# EAGLE design sender v2 (EAGLE 5.10)
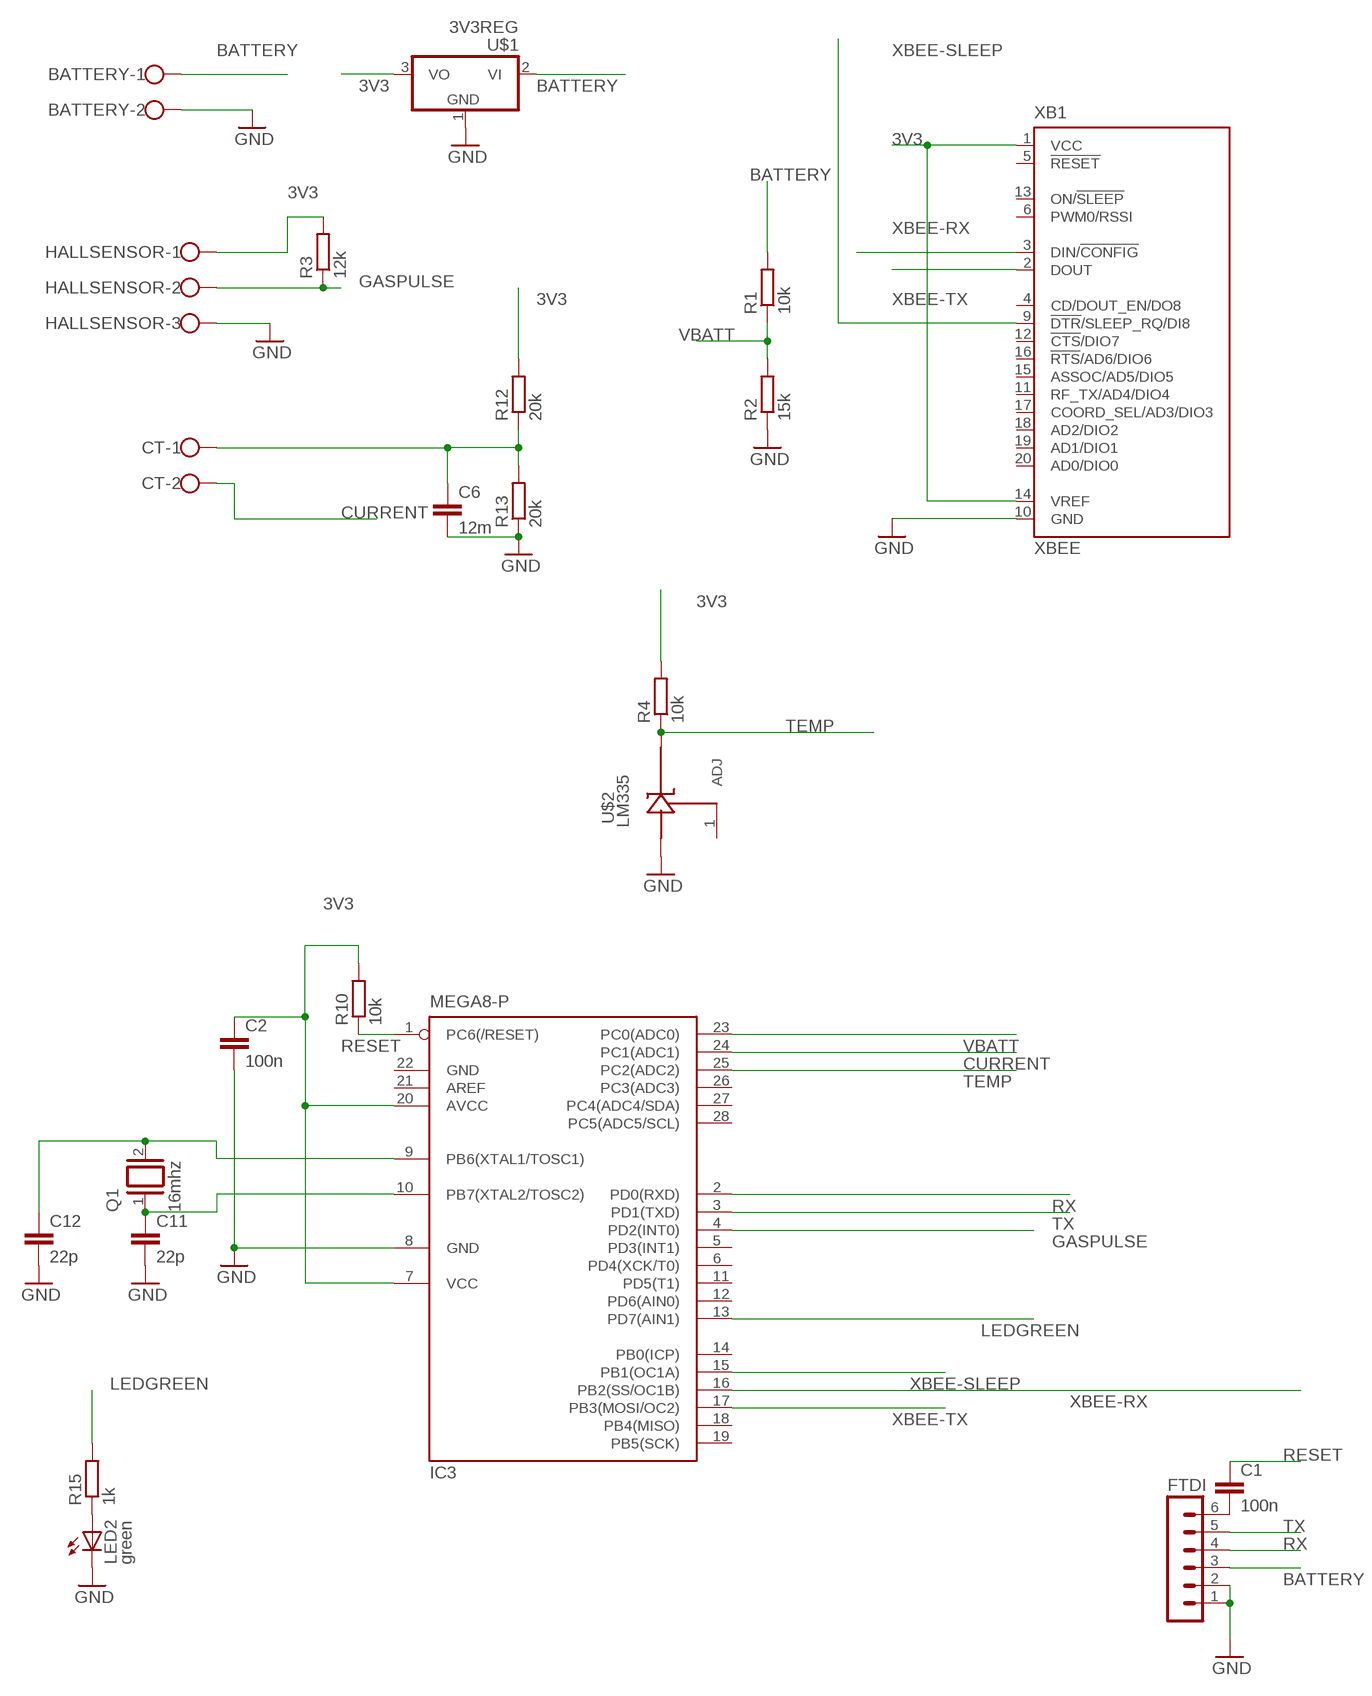
[diagram p0: schematic, sheet 1]

## Parts
BATTERY  W237-102  [W237-102]
C1  100n  C5/2.5  [C5B2.5]
C2  100n  C5/2.5  [C5B2.5]
C6  12m  C5/2.5  [C5B2.5]
C11  22p  C-EU050-025X075  [C050-025X075]
C12  22p  C-EU050-025X075  [C050-025X075]
CT  W237-102  [W237-102]
FTDI  MA06-1  [MA06-1]
HALLSENSOR  W237-103  [W237-103]
IC3  MEGA8-P  [DIL28-3]
LED2  green  LED5MM  [LED5MM]
Q1  16mhz  XTAL/S  [QS]
R1  10k  R-EU_0204/7  [0204/7]
R2  15k  R-EU_0204/7  [0204/7]
R3  12k  R-EU_0204/7  [0204/7]
R4  10k  R-EU_0204/7  [0204/7]
R10  10k  R-EU_0204/7  [0204/7]
R12  20k  R-EU_0204/7  [0204/7]
R13  20k  R-EU_0204/7  [0204/7]
R15  1k  R-EU_0204/7  [0204/7]
U$1  3V3REG  [TO92]
U$2  LM335  [TO92]
XB1  XBEE  [XBEE]

## Nets
3V3: C2.1 HALLSENSOR.1 IC3.7(VCC) IC3.20(AVCC) R3.2 R4.2 R10.2 R12.2 U$1.3(VO) XB1.1(VCC) XB1.14(VREF)
BATTERY [power]: BATTERY.1 FTDI.3 R1.2 U$1.2(VI)
CURRENT: CT.2 IC3.24(PC1(ADC1))
GASPULSE: HALLSENSOR.2 IC3.4(PD2(INT0)) R3.1
GND: BATTERY.2 C2.2 C6.2 C11.2 C12.2 FTDI.1 FTDI.2 HALLSENSOR.3 IC3.8(GND) LED2.K(C) R2.1 R13.1 U$1.1(GND) U$2.3(OUT) XB1.10(GND)
LEDGREEN: IC3.13(PD7(AIN1)) R15.2
N$5: C1.2 FTDI.6
N$10: C11.1 IC3.10(PB7(XTAL2/TOSC2)) Q1.1
N$11: C12.1 IC3.9(PB6(XTAL1/TOSC1)) Q1.2
N$15: LED2.A R15.1
RESET: C1.1 IC3.1(PC6(/RESET)) R10.1
RX: FTDI.4 IC3.2(PD0(RXD))
TEMP: IC3.25(PC2(ADC2)) R4.1 U$2.2(IN)
TX: FTDI.5 IC3.3(PD1(TXD))
VBATT: IC3.23(PC0(ADC0)) R1.1 R2.2
VBIAS: C6.1 CT.1 R12.1 R13.2
XBEE-RX: IC3.16(PB2(SS/OC1B)) XB1.3(DIN/!CONFIG)
XBEE-SLEEP: IC3.15(PB1(OC1A)) XB1.9(!DTR!/SLEEP_RQ/DI8)
XBEE-TX: IC3.17(PB3(MOSI/OC2)) XB1.2(DOUT)
Unconnected: IC3.5(PD3(INT1)) IC3.6(PD4(XCK/T0)) IC3.11(PD5(T1)) IC3.12(PD6(AIN0)) IC3.14(PB0(ICP)) IC3.18(PB4(MISO)) IC3.19(PB5(SCK)) IC3.21(AREF) IC3.26(PC3(ADC3)) IC3.27(PC4(ADC4/SDA)) IC3.28(PC5(ADC5/SCL)) U$2.1(ADJ) XB1.4(CD/DOUT_EN/DO8) XB1.5(!RESET) XB1.6(PWM0/RSSI) XB1.11(RF_TX/AD4/DIO4) XB1.12(!CTS!/DIO7) XB1.13(ON/!SLEEP) XB1.15(ASSOC/AD5/DIO5) XB1.16(!RTS!/AD6/DIO6) XB1.17(COORD_SEL/AD3/DIO3) XB1.18(AD2/DIO2) XB1.19(AD1/DIO1) XB1.20(AD0/DIO0)

## Power pins joined to a net without a drawn wire
GND: IC3.22(GND)

## Library data of the parts
BATTERY CT = con-wago-500:W237-102: WAGO SCREW CLAMP
C1 C2 C6 = capacitor-wima:C: CAPACITOR naming: grid - package width
C11 C12 = rcl:C-EU: CAPACITOR, European symbol
FTDI = con-lstb:MA06-1: PIN HEADER
HALLSENSOR = con-wago-500:W237-103: WAGO SCREW CLAMP
IC3 = atmel:MEGA8-P: MICROCONTROLLER 8 Kbytes FLASH, 1 kbytes SRAM, 512 bytes EEPROM, USART, 4-channel 10 bit ADC, 2-channel 8 bit ADC Pin compatible with Atmega48, ATMega88, ATMega168 Source: avr.lbr
LED2 = led:LED: LED OSRAM: - CHIPLED LG R971, LG N971, LY N971, LG Q971, LY Q971, LO R971, LY R971 LH N974, LH R974 LS Q976, LO Q976, LY Q976 LO Q996 - Hyper CHIPLED LW Q18S LB Q993, LB Q99A, LB R99A - SideLED LS A670, LO A670, LY A670, LG A670, LP A670 LB A673, LV A673, LT A673, LW A673 LH A674 LY A675 LS A676, LA A676, LO A676, LY A676, LW A676 LS A679, LY A679, LG A679 - Hyper Micro SIDELED® LS Y876, LA Y876, LO Y876, LY Y876 LT Y87S - SmartLED LW L88C, LW L88S LB L89C, LB L89S, LG L890 LS L89K, LO L89K, LY L89K LS L896, LA L896, LO L896, LY L896 - TOPLED LS T670, LO T670, LY T670, LG T670, LP T670 LSG T670, LSP T670, LSY T670, LOP T670, LYG T670 LG T671, LOG T671, LSG T671 LB T673, LV T673, LT T673, LW T673 LH T674 LS T676, LA T676, LO T676, LY T676, LB T676, LH T676, LSB T676, LW T676 LB T67C, LV T67C, LT T67C, LS T67K, LO T67K, LY T67K, LW E67C LS E67B, LA E67B, LO E67B, LY E67B, LB E67C, LV E67C, LT E67C LW T67C LS T679, LY T679, LG T679 LS T770, LO T770, LY T770, LG T770, LP T770 LB T773, LV T773, LT T773, LW T773 LH T774 LS E675, LA E675, LY E675, LS T675 LS T776, LA T776, LO T776, LY T776, LB T776 LHGB T686 LT T68C, LB T68C - Hyper Mini TOPLED® LB M676 - Mini TOPLED Santana® LG M470 LS M47K, LO M47K, LY M47K Source: http://www.osram.convergy.de LUXEON: - LUMILED® LXK2-PW12-R00, LXK2-PW12-S00, LXK2-PW14-U00, LXK2-PW14-V00 LXK2-PM12-R00, LXK2-PM12-S00, LXK2-PM14-U00 LXK2-PE12-Q00, LXK2-PE12-R00, LXK2-PE12-S00, LXK2-PE14-T00, LXK2-PE14-U00 LXK2-PB12-K00, LXK2-PB12-L00, LXK2-PB12-M00, LXK2-PB14-N00, LXK2-PB14-P00, LXK2-PB14-Q00 LXK2-PR12-L00, LXK2-PR12-M00, LXK2-PR14-Q00, LXK2-PR14-R00 LXK2-PD12-Q00, LXK2-PD12-R00, LXK2-PD12-S00 LXK2-PH12-R00, LXK2-PH12-S00 LXK2-PL12-P00, LXK2-PL12-Q00, LXK2-PL12-R00 Source: www.luxeon.com KINGBRIGHT: KA-3528ASYC Source: www.kingbright.com
Q1 = special:XTAL/S: CRYSTAL
R1-R4 R10 R12 R13 R15 = rcl:R-EU_: RESISTOR, European symbol
U$1 = matt:3V3REG
U$2 = matt:LM335
XB1 = maxstream:XBEE: XBee (TM) /XBee-PRO(TM) OEM RF Modules Source: MaxStream, Inc. xbee_productmanual.pdf

## Net classes
1 power: width 2 mm

## Board
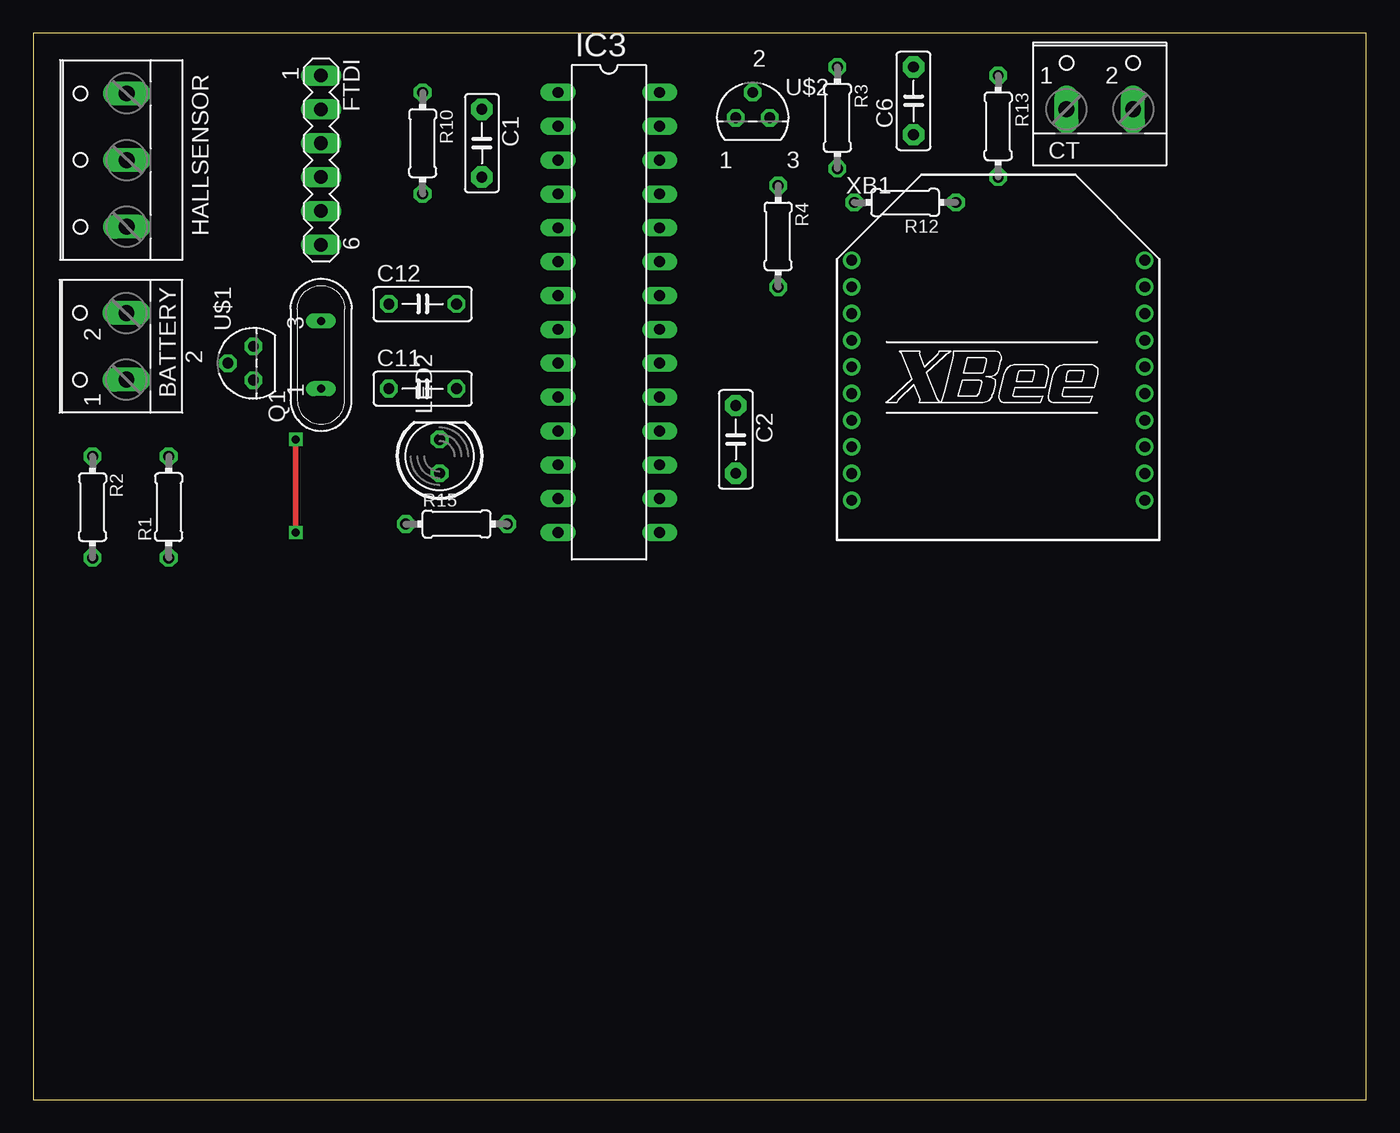
[diagram p1: board, top side]
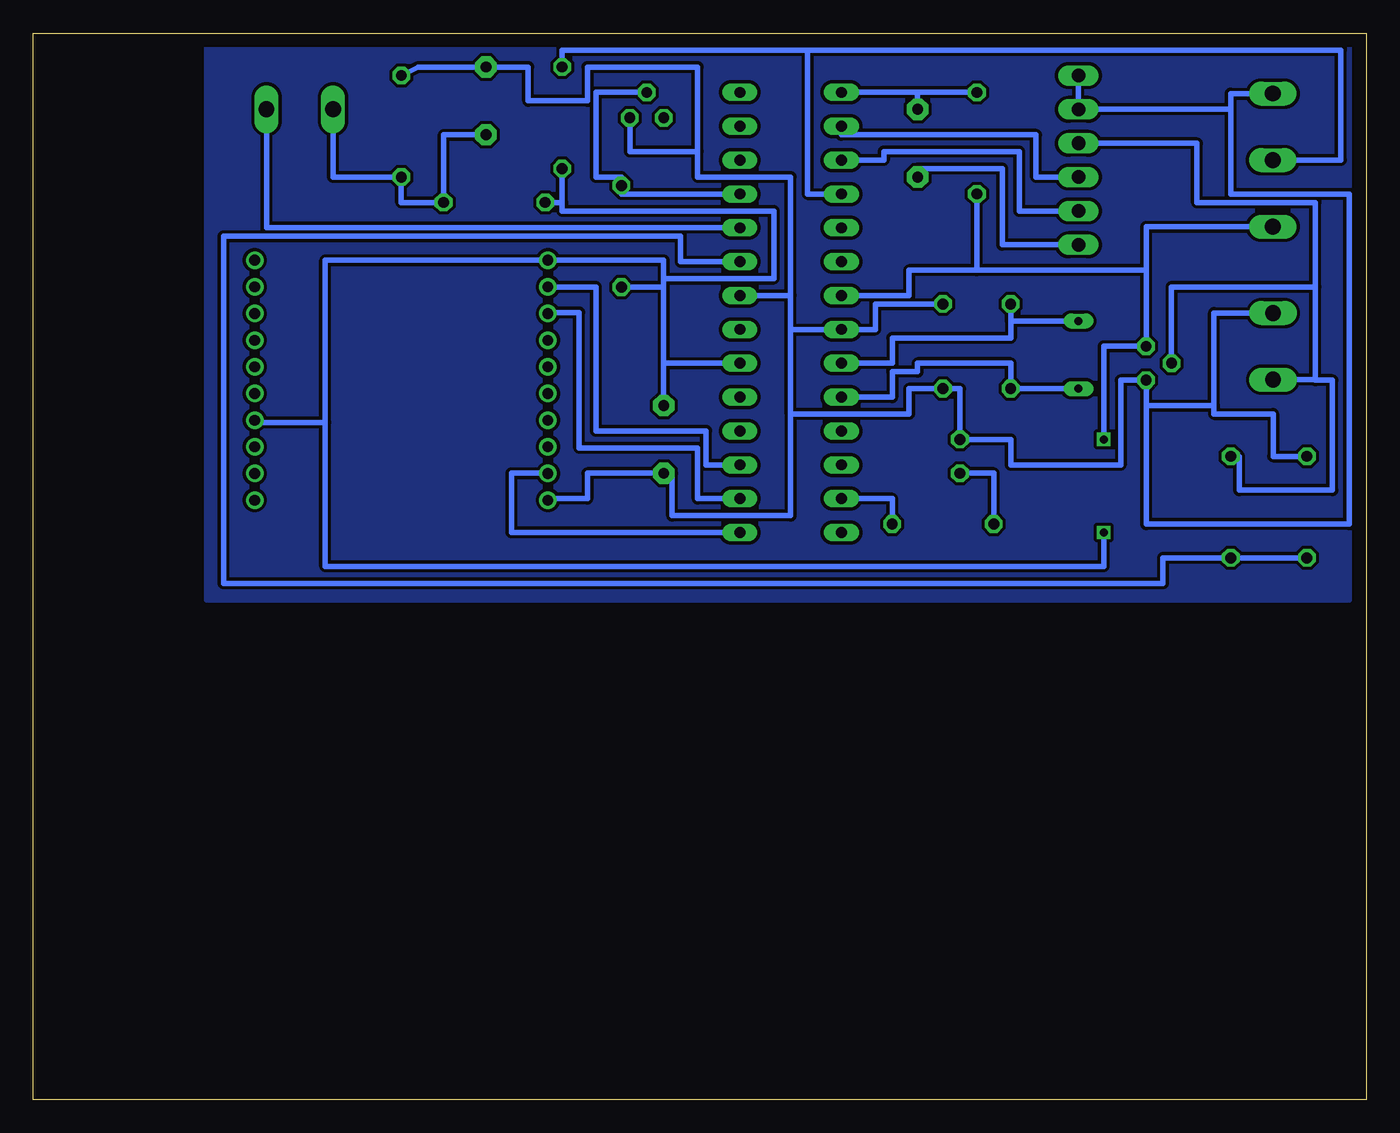
[diagram p2: board, bottom side, seen from below]

Size 100 x 80 mm. Coordinates in mm from the lower left corner, seen from the top.
Outline: 0,0 100,0 100,80 0,80 0,0
Copper layers (1*16): Top 0.035mm / dielectric 1.5mm / Bottom 0.035mm
Design rules "default *": minimum track width 10mil, minimum drill 24mil, track to track 8mil, track to pad 8mil, pad to pad 8mil, via to via 8mil, smd to smd 8mil, copper to edge 40mil, drill to drill 8mil, minimum pad ring 10mil, minimum via ring 8mil, stop-mask expansion 4mil, vias tented up to drill 0mil, thermal gap 10mil

### Footprints (pad centres in the part's own frame; a part is rotated, then mirrored left to right if it is on the bottom)
W237-102 = drill 1.194 long: 1 -2.5,-1.27; 2 2.5,-1.27
C5B2.5 = drill 0.813 pad 1.6 octagon: 1 -2.54,0; 2 2.54,0
C050-025X075 = drill 0.813 octagon: 1 -2.54,0; 2 2.54,0
MA06-1 = drill 1.016 long: 1 -6.35,0; 2 -3.81,0; 3 -1.27,0; 4 1.27,0; 5 3.81,0; 6 6.35,0
W237-103 = drill 1.194 long: 1 -5,-1.29; 2 0,-1.29; 3 5,-1.29
DIL28-3 = drill 0.813 long: 1 -16.51,-3.81; 2 -13.97,-3.81; 3 -11.43,-3.81; 4 -8.89,-3.81; 5 -6.35,-3.81; 6 -3.81,-3.81; 7 -1.27,-3.81; 8 1.27,-3.81; 9 3.81,-3.81; 10 6.35,-3.81; 11 8.89,-3.81; 12 11.43,-3.81; 13 13.97,-3.81; 14 16.51,-3.81; 15 16.51,3.81; 16 13.97,3.81; 17 11.43,3.81; 18 8.89,3.81; 19 6.35,3.81; 20 3.81,3.81; 21 1.27,3.81; 22 -1.27,3.81; 23 -3.81,3.81; 24 -6.35,3.81; 25 -8.89,3.81; 26 -11.43,3.81; 27 -13.97,3.81; 28 -16.51,3.81
LED5MM = drill 0.813 octagon: A -1.27,0; K 1.27,0
QS = drill 0.61 long: 1 -2.54,0; 2 2.54,0
0204/7 = drill 0.813 octagon: 1 -3.81,0; 2 3.81,0
TO92 = drill 0.813 octagon: 1 -1.27,0; 2 0,1.905; 3 1.27,0
XBEE = drill 0.8 pad 1.27 round: 1 -11,9; 2 -11,7; 3 -11,5; 4 -11,3; 5 -11,1; 6 -11,-1; 7 -11,-3; 8 -11,-5; 9 -11,-7; 10 -11,-9; 11 11,-9; 12 11,-7; 13 11,-5; 14 11,-3; 15 11,-1; 16 11,1; 17 11,3; 18 11,5; 19 11,7; 20 11,9

### Placement (x,y rotation side)
BATTERY  5.71,56.52 90 top
C1  33.66,71.75 270 top
C2  52.7,49.53 270 top
C6  66.04,74.93 90 top
C11  29.21,53.34 0 top
C12  29.21,59.69 0 top
CT  80.01,75.56 0 top
FTDI  21.59,70.48 270 top
HALLSENSOR  5.71,70.48 90 top
IC3  43.18,59.05 270 top
LED2  30.48,48.26 90 top
Q1  21.59,55.88 90 top
R1  10.16,44.45 90 top
R2  4.45,44.45 270 top
R3  60.33,73.66 270 top
R4  55.88,64.77 270 top
R10  29.21,71.75 270 top
R12  65.41,67.31 180 top
R13  72.39,73.03 270 top
R15  31.75,43.18 0 top
U$1  16.51,55.24 90 top
U$2  53.98,73.66 0 top
XB1  72.39,53.98 0 top

### Tracks (layer width: path | path; a pad name or v marks a point on that pad's centre or on a via)
3V3  (via drill 0.6)
  Top 0.406: v19.68,42.55 v19.68,49.53
  Bottom 0.406: HALLSENSOR.1 16.51,65.48 16.51,62.23 | 78.11,50.8 78.11,62.98 XB1.1 52.7,62.98 52.7,61.59 | 78.11,50.8 83.39,50.8 XB1.14 | v19.68,49.53 19.68,56.52 U$1.3 16.51,62.23 | v19.68,42.55 19.68,40.01 78.11,40.01 78.11,50.8 | IC3.7 34.29,60.33 34.29,62.23 29.21,62.23 | 16.51,62.23 29.21,62.23 | 29.21,62.23 R10.2 | 52.7,60.96 52.7,55.88 52.7,55.24 | 52.7,55.24 C2.1 | 52.7,60.96 R4.2 | 52.7,61.59 52.7,60.96 | 60.33,67.31 R12.2 | 60.33,67.31 60.33,66.67 44.45,66.67 44.45,61.59 52.7,61.59 | 60.33,67.31 R3.2 | 52.7,55.24 IC3.20
BATTERY
  Bottom 0.406: 3.81,54.02 BATTERY.1 | 3.81,54.02 3.81,60.96 | 3.81,60.96 14.61,60.96 U$1.2 | R1.2 9.53,48.26 9.53,45.72 2.54,45.72 2.54,53.98 3.81,53.98 3.81,54.02 | 3.81,60.96 3.81,67.31 12.7,67.31 12.7,71.75 FTDI.3
CURRENT
  Bottom 0.406: IC3.24 82.51,65.41 CT.2
GASPULSE
  Bottom 0.406: HALLSENSOR.2 1.91,70.48 1.91,78.74 41.91,78.74 | 41.91,78.74 60.33,78.74 R3.1 | IC3.4 41.91,67.94 41.91,78.74
GND
  Bottom 0.406: FTDI.1 FTDI.2 10.16,74.3 | 43.18,51.44 43.18,57.78 | 43.18,51.44 43.18,43.81 52.07,43.81 52.07,46.99 C2.2 58.42,46.99 58.42,45.09 61.39,45.09 XB1.10 | BATTERY.2 11.43,59.02 11.43,52.07 | 16.51,52.07 11.43,52.07 | 16.51,52.07 U$1.1 18.41,53.98 18.41,47.62 26.67,47.62 26.67,49.53 LED2.K 30.48,53.34 C11.2 34.29,53.34 34.29,51.44 43.18,51.44 | R2.1 6.99,48.26 6.99,51.44 11.43,51.44 11.43,52.07 | HALLSENSOR.3 10.16,75.48 10.16,74.3 | 10.16,74.3 10.16,67.94 1.27,67.94 1.27,43.18 16.51,43.18 16.51,52.07 | C12.2 36.83,59.69 36.83,57.78 IC3.8 43.18,57.78 | 43.18,57.78 43.18,60.33 | 43.18,60.33 IC3.22 | R13.1 71.12,77.47 C6.2 62.87,77.47 62.87,74.93 58.42,74.93 58.42,77.47 50.16,77.47 50.16,71.12 | 50.16,71.12 55.24,71.12 U$2.3 | 43.18,60.33 43.18,69.22 50.16,69.22 50.16,71.12
LEDGREEN
  Bottom 0.406: R15.2 35.56,45.09 IC3.13
N$1
  pour Bottom (isolate 0.25): 1.27,79.38 87,79.38 87,37.47 1.27,37.47
N$5
  Bottom 0.406: C1.2 33.66,69.85 27.3,69.85 27.3,64.14 FTDI.6
N$10
  Bottom 0.406: Q1.1 C11.1 26.67,55.24 33.66,55.24 33.66,54.61 35.56,54.61 35.56,52.7 IC3.10
N$11
  Bottom 0.406: Q1.2 26.67,58.42 | 26.67,58.42 C12.1 | 26.67,58.42 26.67,57.15 35.56,57.15 35.56,55.24 IC3.9
N$15
  Bottom 0.406: LED2.A 27.94,46.99 R15.1
RESET
  Bottom 0.406: R10.1 33.66,75.56 | 33.66,75.56 C1.1 | 33.66,75.56 IC3.1
RX
  Bottom 0.406: IC3.2 39.37,72.39 24.77,72.39 24.77,69.22 FTDI.4
TEMP
  Bottom 0.406: U$2.2 57.78,75.56 57.78,69.22 55.88,69.22 R4.1 55.88,67.94 IC3.25
TX
  Bottom 0.406: IC3.3 36.2,70.48 36.2,71.12 26.04,71.12 26.04,66.67 FTDI.5
VBATT
  Bottom 0.406: R2.2 R1.1 15.24,40.64 15.24,38.73 85.72,38.73 85.72,64.77 51.44,64.77 51.44,62.87 IC3.23
VBIAS
  Bottom 0.406: C6.1 69.22,72.39 R12.1 72.39,67.31 R13.2 77.51,69.22 CT.1
XBEE-RX
  Bottom 0.406: IC3.16 50.16,45.09 50.16,48.9 59.05,48.9 59.05,59.05 61.39,59.05 XB1.3
XBEE-SLEEP
  Bottom 0.406: IC3.15 64.14,42.55 64.14,46.99 XB1.9
XBEE-TX
  Bottom 0.406: IC3.17 49.53,47.62 49.53,50.16 57.78,50.16 57.78,60.96 61.39,60.96 XB1.2